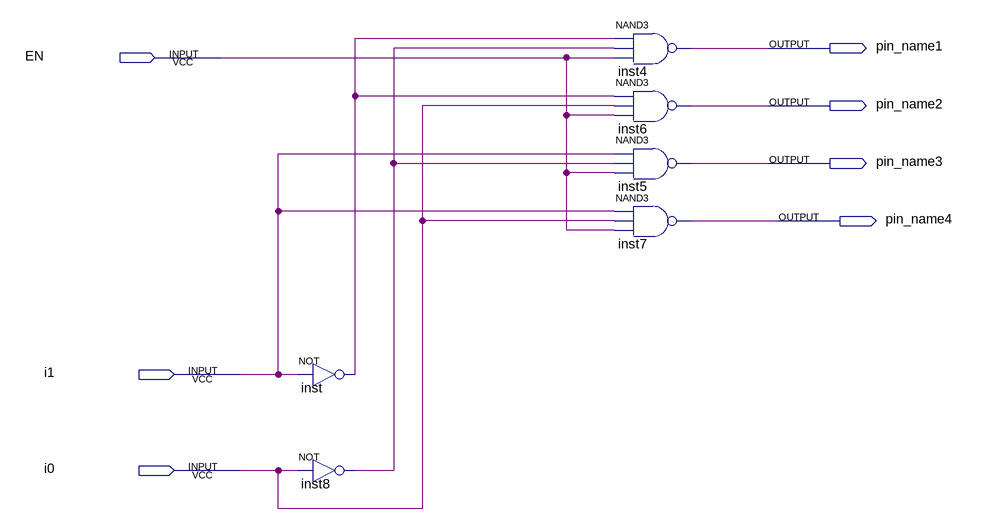
[diagram p0: schematic sheet]
// Quartus schematic test001.bdf as structural Verilog: 6 symbols, 7 pins
module test001 (
  input  EN,
  input  i1,
  input  i0,
  output pin_name1,
  output pin_name2,
  output pin_name3,
  output pin_name4
);

  wire inst8_out, inst_out;

  not inst (inst_out, i1);
  not inst8 (inst8_out, i0);
  nand inst4 (pin_name1, inst_out, inst8_out, EN);
  nand inst6 (pin_name2, inst_out, i0, EN);
  nand inst5 (pin_name3, i1, inst8_out, EN);
  nand inst7 (pin_name4, i1, i0, EN);
endmodule
